# Altium project Project_MCU_Calculator.PrjPcb
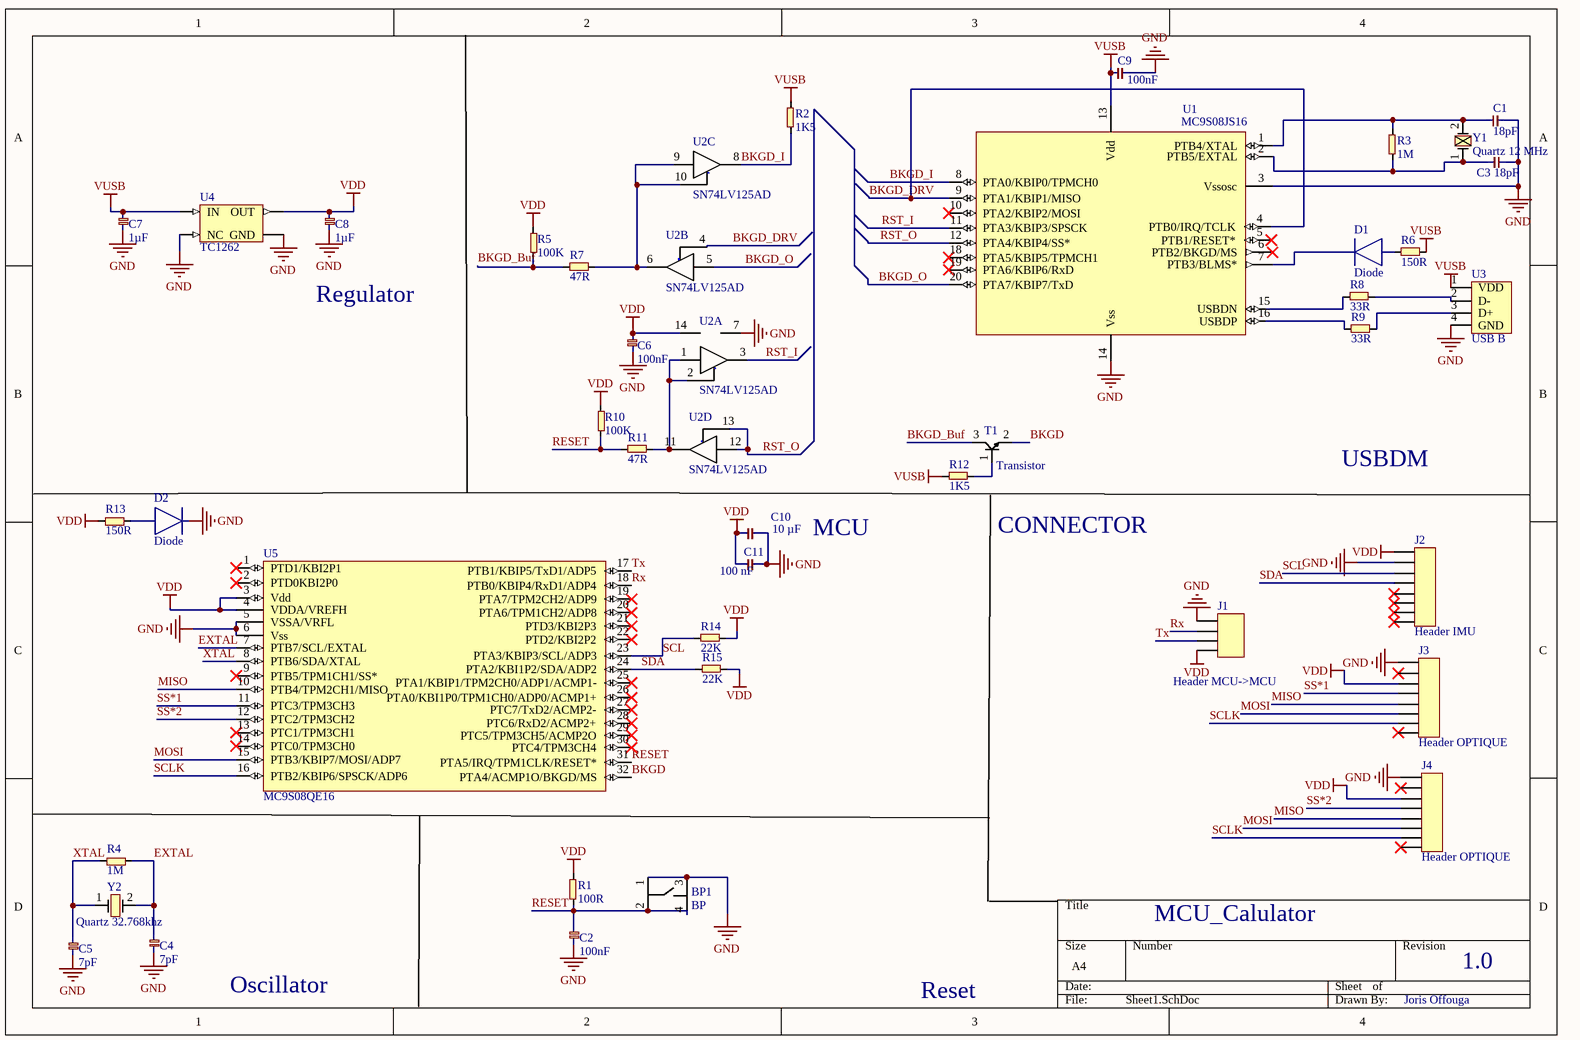
[diagram p0: Sheet1.SchDoc]
1 sheet, 41 parts. Net scope: global (net labels, ports and power ports of the same name join across sheets).
Board file: PCB1.PcbDoc

## Sheet Sheet1.SchDoc
size A4

### Parts
BP1  BP  [BP]
C1  18pF  [0805]
C2  100nF  [0805]
C3  18pF  [0805]
C4  7pF  [0805]
C5  7pF  [0805]
C6  100nF  [0805]
C7  1µF  [0805]
C8  1µF  [0805]
C9  100nF  [0805]
C10  10 µF  [0805]
C11  100 nF  [0805]
D1  Diode  [led]
D2  Diode  [led]
J1  Header MCU->MCU  [Header 4]
J2  Header IMU  [Header 8]
J3  Header OPTIQUE  [Header 8]
J4  Header OPTIQUE  [Header 8]
R1  100R  [0805]
R2  1K5  [0805]
R3  1M  [0805]
R4  1M  [0805]
R5  100K  [0805]
R6  150R  [0805]
R7  47R  [0805]
R8  33R  [0805]
R9  33R  [0805]
R10  100K  [0805]
R11  47R  [0805]
R12  1K5  [0805]
R13  150R  [0805]
R14  22K  [0805]
R15  22K  [0805]
T1  Transistor  [Transistor]
U1  MC9S08JS16  [MC9S08JS16]
U2  SN74LV125AD  [SN74LV125AD]  (parts A,B,C,D of 4)
U3  USB B  [USB_B]
U4  TC1262  [TC1262]
U5  MC9S08QE16  [LQFP_32]
Y1  Quartz 12 MHz  [Quartz]
Y2  Quartz 32.768khz  [Quartz 32.768kHZ]

### Nets
GND: BP1.1 BP1.3 C1.2 C2.1 C3.2 C4.1 C5.1 C6.2 C7.1 C8.1 C9.2 C10.2 C11.2 D2.2 J1.1 J2.2 J3.1 J4.1 U1.3(Vssosc) U1.14(Vss) U2.7 U3.4(GND) U4.2(GND) U4.4(NC) U5.5(VSSA/VRFL) U5.6(Vss)
VDD: C6.1 C8.2 C10.1 C11.1 J1.4 J2.1 J3.3 J4.3 R1.2 R5.1 R10.1 R13.2 R14.2 R15.2 U2.14 U4.3(OUT) U5.3(Vdd) U5.4(VDDA/VREFH)
VUSB: C7.2 C9.1 R2.2 R6.2 R12.1 U1.13(Vdd) U3.1(VDD) U4.1(IN)
BKGD: T1.2 U5.32(PTA4/ACMP1O/BKGD/MS)
BKGD_Buf: R5.2 R7.1 T1.3
BKGD_DRV: U1.4(PTB0/IRQ/TCLK) U1.9(PTA1/KBIP1/MISO) U2.4
BKGD_I: R2.1 U1.8(PTA0/KBIP0/TPMCH0) U2.8
BKGD_O: U1.20(PTA7/KBIP7/TxD) U2.5
EXTAL: C4.2 R4.1 U5.7(PTB7/SCL/EXTAL) Y2.2
MISO: J3.5 J4.5 U5.10(PTB4/TPM2CH1/MISO)
MOSI: J3.6 J4.6 U5.15(PTB3/KBIP7/MOSI/ADP7)
RESET: BP1.2 BP1.4 C2.2 R1.1 R10.2 R11.1 U5.31(PTA5/IRQ/TPM1CLK/RESET*)
RST_I: U1.11(PTA3/KBIP3/SPSCK) U2.3
RST_O: U1.12(PTA4/KBIP4/SS*) U2.12 U2.13
Rx: J1.2 U5.18(PTB0/KBIP4/RxD1/ADP4)
SCL: J2.3 R14.1 U5.23(PTA3/KBIP3/SCL/ADP3)
SCLK: J3.7 J4.7 U5.16(PTB2/KBIP6/SPSCK/ADP6)
SDA: J2.4 R15.1 U5.24(PTA2/KBI1P2/SDA/ADP2)
SS*1: J3.4 U5.11(PTC3/TPM3CH3)
SS*2: J4.4 U5.12(PTC2/TPM3CH2)
Tx: J1.3 U5.17(PTB1/KBIP5/TxD1/ADP5)
XTAL: C5.2 R4.2 U5.8(PTB6/SDA/XTAL) Y2.1
NetC1_1: C1.1 R3.2 U1.1(PTB4/XTAL) Y1.2
NetC3_1: C3.1 R3.1 U1.2(PTB5/EXTAL) Y1.1
NetD1_1: D1.1 R6.1
NetD1_2: D1.2 U1.7(PTB3/BLMS*)
NetD2_1: D2.1 R13.1
NetR7_2: R7.2 U2.6 U2.9 U2.10
NetR8_1: R8.1 U1.15(USBDN)
NetR8_2: R8.2 U3.2(D-)
NetR9_1: R9.1 U1.16(USBDP)
NetR9_2: R9.2 U3.3(D+)
NetR11_2: R11.2 U2.1 U2.2 U2.11
NetR12_2: R12.2 T1.1

Not connected (* = marked no-connect by the designer): J2 5* 6* 7* 8*; J3 2* 8*; J4 2* 8*; U1 5(PTB1/RESET*)* 6(PTB2/BKGD/MS)* 10(PTA2/KBIP2/MOSI)* 18(PTA5/KBIP5/TPMCH1)* 19(PTA6/KBIP6/RxD)*; U5 1(PTD1/KBI2P1)* 2(PTD0KBI2P0)* 9(PTB5/TPM1CH1/SS*)* 13(PTC1/TPM3CH1)* 14(PTC0/TPM3CH0)* 19(PTA7/TPM2CH2/ADP9)* 20(PTA6/TPM1CH2/ADP8)* 21(PTD3/KBI2P3)* 22(PTD2/KBI2P2)* 25(PTA1/KBIP1/TPM2CH0/ADP1/ACMP1-)* 26(PTA0/KBI1P0/TPM1CH0/ADP0/ACMP1+)* 27(PTC7/TxD2/ACMP2-)* 28(PTC6/RxD2/ACMP2+)* 29(PTC5/TPM3CH5/ACMP2O)* 30(PTC4/TPM3CH4)*

### Notes on the sheet
- Regulator
- USBDM
- MCU
- CONNECTOR
- MCU_Calulator
- Oscillator
- 1.0
- Reset
- Joris Offouga

### Library data of the parts
C1-C11 = Condensateur
D1 D2 = Diode: led
J1 = Header 4
J2-J4 = Header
R1-R15 = Resistance
Y1 = Quartz